# Altium project Probe.PrjPCB
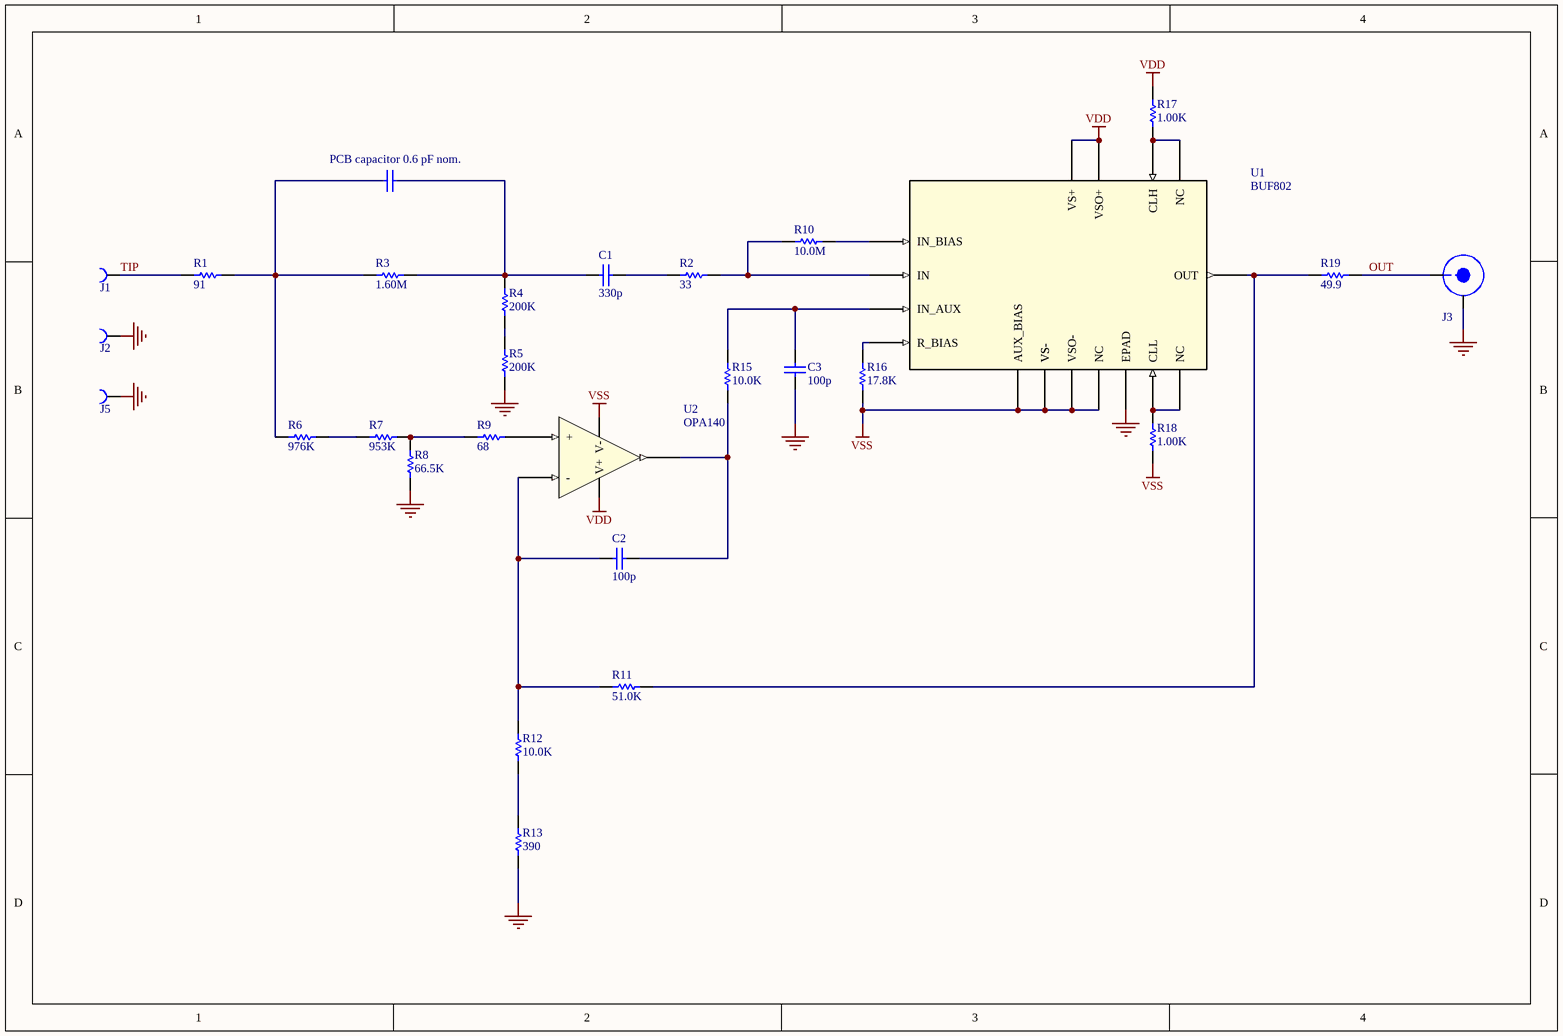
[diagram p0: Probe.SchDoc]
2 sheets, 57 parts. Net scope: global (net labels, ports and power ports of the same name join across sheets).
Board file: Probe.PcbDoc
Sheets:
  Probe.SchDoc
  Power.SchDoc

## Sheet Probe.SchDoc: Active probe evaluation board
size A4

### Parts
C1  330p  [CAPC0402(1005)50_M]
C2  100p  [CAPC0402(1005)50_M]
C3  100p  [CAPC0402(1005)50_M]
J1  0339-0-15-01-15-27-10-0  [MILL-MAX 0339]  (value not drawn)
J2  0339-0-15-01-15-27-10-0  [MILL-MAX 0339]  (value not drawn)
J3  901-10511-3  [901-10511-3]  (value not drawn)
J5  0339-0-15-01-15-27-10-0  [MILL-MAX 0339]  (value not drawn)
R1  91  [RESC0402(1005)_M]
R2  33  [RESC0402(1005)_M]
R3  1.60M  [RESC0402(1005)_M]
R4  200K  [RESC0402(1005)_M]
R5  200K  [RESC0402(1005)_M]
R6  976K  [RESC0402(1005)_M]
R7  953K  [RESC0402(1005)_M]
R8  66.5K  [RESC0402(1005)_M]
R9  68  [RESC0402(1005)_M]
R10  10.0M  [RESC0402(1005)_M]
R11  51.0K  [RESC0402(1005)_M]
R12  10.0K  [RESC0402(1005)_M]
R13  390  [RESC0402(1005)_M]
R15  10.0K  [RESC0402(1005)_M]
R16  17.8K  [RESC0402(1005)_M]
R17  1.00K  [RESC0402(1005)_M]
R18  1.00K  [RESC0402(1005)_M]
R19  49.9  [RESC0402(1005)_M]
U1  BUF802  [VQFN16_RGT_TEX- OSHPARK]
U2  OPA140  [SOIC-8]

### Nets
GND: C3.2 J2.1 J3.2 J5.1 R5.2 R8.2 R13.2 U1.17(EPAD)
VDD: R17.2 U1.1(VS+) U1.12(VSO+) U2.7(V+)
VSS: R16.2 R18.2 U1.5(VS-) U1.6(AUX_BIAS) U1.8(VS-) U1.9(NC) U1.10(VSO-) U2.4(V-)
OUT: J3.1 R19.2
TIP: J1.1 R1.1
NetC1_1: C1.1 R3.2 R4.1
NetC1_2: C1.2 R2.1
NetC2_1: C2.1 R11.1 R12.1 U2.2(-)
NetC2_2: C2.2 R15.2 U2.6(OUT)
NetC3_1: C3.1 R15.1 U1.4(IN_AUX)
NetR1_2: R1.2 R3.1 R6.1
NetR2_2: R2.2 R10.1 U1.2(IN)
NetR4_2: R4.2 R5.1
NetR6_2: R6.2 R7.1
NetR7_2: R7.2 R8.1 R9.1
NetR9_2: R9.2 U2.3(+)
NetR10_2: R10.2 U1.3(IN_BIAS)
NetR11_2: R11.2 R19.1 U1.11(OUT)
NetR12_2: R12.2 R13.1
NetR16_1: R16.1 U1.7(R_BIAS)
NetR17_1: R17.1 U1.15(CLH) U1.16(NC)
NetR18_1: R18.1 U1.13(NC) U1.14(CLL)

### Notes on the sheet
- PCB capacitor 0.6 pF nom.
- Title
- Size:
- Date:
- A4
- Number:
- Time:
- Revision:
- Sheet
- of
- File:

### Library data of the parts
C1 = GRM1555C1H331JA01: CAP CER 330PF±5% 50V C0G 0402; Manufacturer: Murata; Manufacturer Part Number: GRM1555C1H331JA01D; Capacitance: 330pF; Tolerance: ±5%; Value: 330p; Temperature Coefficient: C0G; Part Number: GRM1555C1H331JA01
C2 C3 = CL05C101JB5NNN: CAP CER 100PF±5% 50V C0G 0402; Manufacturer: Samsung Electro-Mechanics; Manufacturer Part Number: CL05C101JB5NNNC; Capacitance: 100pF; Tolerance: ±5%; Voltage Rating: 50V; Temperature Coefficient: C0G; Part Number: CL05C101JB5NNN; Value: 100p
J1 J2 J5 = 0339-0-15-01-15-27-10-0: CONN PIN RCPT; Manufacturer: Mill-Max; Supplier 1: Digi-Key; Supplier Part Number 1: 0339-0-15-01-15-27-10-0-ND; Manufacturer Part Number: 0339-0-15-01-15-27-10-0; Stock 1: 989; Pricing 1: 1=1.42, 10=1.234, 25=1.1812, 50=1.155, 100=1.1025, 250=0.99748, 500=0.91874, 1000=0.7875, 2500=0.735 (USD); Contact Material: Copper; Contact Plating: Gold; Min Operating Temperature: -55°C; Max Operating Temperature: 125°C; Series: 0339; Packaging: Bulk; Termination: Solder; RoHS Compliant: No; ComponentLink1URL: https://www.mill-max.com/assets/pdfs/172.pdf?src-supplier=Digi-Key; ComponentLink1Description: https://www.mill-max.com/assets/pdfs/172.pdf?src-supplier=Digi-Key; ComponentLink2URL: https://datasheet.octopart.com/0339-0-15-01-15-27-10-0-Mill-Max-datasheet-26446830.pdf?src-supplier=Future+Electronics; ComponentLink2Description: https://datasheet.octopart.com/0339-0-15-01-15-27-10-0-Mill-Max-datasheet-26446830.pdf?src-supplier=Future+Electronics; ComponentLink3URL: http://www.mouser.com/ds/2/273/172M-276194.pdf?src-supplier=Mouser; ComponentLink3Description: http://www.mouser.com/ds/2/273/172M-276194.pdf?src-supplier=Mouser; ComponentLink4URL: https://datasheet.octopart.com/0339-0-15-01-15-27-10-0-Mill-Max-datasheet-155663258.pdf?src-supplier=Sager+Electronics; ComponentLink4Description: https://datasheet.octopart.com/0339-0-15-01-15-27-10-0-Mill-Max-datasheet-155663258.pdf?src-supplier=Sager+Electronics; Supplier 2: Mouser; Supplier Part Number 2: 575-0339015011527100
J3 = 901-10511-3: CONN SMA JACK STR 50OHM EDGE MNT; Manufacturer: Amphenol RF; Impedance: 50R; Max Frequency: 26.5GHz; Voltage Rating: 170V; Supplier 1: Digi-Key; Manufacturer Part Number: 901-10511-3; Stock 1: 1568; Pricing 1: 1=9.78, 10=8.804, 25=8.2936, 50=8.081, 100=7.8684, 250=7.01772, 500=6.59242, 1000=5.82685 (USD); Case/Package: SMA; Contact Material: Copper; Min Operating Temperature: -65°C; Max Operating Temperature: 165°C; Connector Type: SMA; Fastening Type: Threaded; Series: -; Packaging: Bulk; Termination: Solder; ComponentLink1URL: https://datasheet.octopart.com/901-10511-3-Amphenol-RF-datasheet-67291285.pdf?src-supplier=Element14; ComponentLink1Description: https://datasheet.octopart.com/901-10511-3-Amphenol-RF-datasheet-67291285.pdf?src-supplier=Element14; Supplier 2: Mouser; Supplier Part Number 2: 523-901-10511-3; Supplier Part Number 1: ARF2500-ND; Mount: Edge,Board; RoHS Compliant: Yes; ComponentLink2URL: https://datasheet.octopart.com/901-10511-3-Amphenol-RF-datasheet-67291280.pdf?src-supplier=Newark; ComponentLink2Description: https://datasheet.octopart.com/901-10511-3-Amphenol-RF-datasheet-67291280.pdf?src-supplier=Newark; ComponentLink3URL: http://www.amphenolrf.com/media/downloads/7776/C901-10511-3.pdf?src-supplier=Digi-Key; ComponentLink3Description: http://www.amphenolrf.com/media/downloads/7776/C901-10511-3.pdf?src-supplier=Digi-Key
R1 = RESC0402-91R0-1pct: RES 91 OHM 1% 1/16W 0402; Manufacturer 1: Yageo; Manufacturer Part Number 1: RC0402FR-0791RL; Part Number: RESC0402-91R0-1pct; Ohms: 91; Value: 91; Manufacturer 2: Stackpole Electronics; Manufacturer Part Number 2: RMCF0402FT91R0; Manufacturer 3: Vishay Dale; Manufacturer Part Number 3: CRCW040291R0FKED; Manufacturer 4: Panasonic Electronic Components; Manufacturer Part Number 4: ERJ-2RKF91R0X
R2 = RESC0402-33R0-1pct: RES 33 OHM 1% 1/16W 0402; Manufacturer 1: Yageo; Manufacturer Part Number 1: RC0402FR-0733RL; Part Number: RESC0402-33R0-1pct; Ohms: 33; Value: 33; Manufacturer 2: Stackpole Electronics; Manufacturer Part Number 2: RMCF0402FT33R0; Manufacturer 3: Vishay Dale; Manufacturer Part Number 3: CRCW040233R0FKED; Manufacturer 4: Panasonic Electronic Components; Manufacturer Part Number 4: ERJ-2RKF33R0X
R3 = RESC0402-1M60-1pct: RES 1.60M OHM 1% 1/16W 0402; Manufacturer 1: Yageo; Manufacturer Part Number 1: RC0402FR-071M6L; Ohms: 1600000; Part Number: RESC0402-1M60-1pct; Value: 1.60M; Manufacturer 2: Stackpole Electronics; Manufacturer Part Number 2: RMCF0402FT1M60; Manufacturer 3: Vishay Dale; Manufacturer Part Number 3: CRCW04021M60FKED; Manufacturer 4: Panasonic Electronic Components
R4 R5 = RESC0402-200K-1pct: RES 200K OHM 1% 1/16W 0402; Manufacturer 1: Yageo; Manufacturer Part Number 1: RC0402FR-07200KL; Ohms: 200000; Part Number: RESC0402-200K-1pct; Value: 200K; Manufacturer 2: Stackpole Electronics; Manufacturer Part Number 2: RMCF0402FT200K; Manufacturer 3: Vishay Dale; Manufacturer Part Number 3: CRCW0402200KFKED; Manufacturer 4: Panasonic Electronic Components; Manufacturer Part Number 4: ERJ-2RKF2003X
R6 = RESC0402-976K-1pct: RES 976K OHM 1% 1/16W 0402; Manufacturer 1: Yageo; Manufacturer Part Number 1: RC0402FR-07976KL; Ohms: 976000; Part Number: RESC0402-976K-1pct; Value: 976K; Manufacturer 2: Stackpole Electronics; Manufacturer Part Number 2: RMCF0402FT976K; Manufacturer 3: Vishay Dale; Manufacturer Part Number 3: CRCW0402976KFKED; Manufacturer 4: Panasonic Electronic Components; Manufacturer Part Number 4: ERJ-2RKF9763X
R7 = RESC0402-953K-1pct: RES 953K OHM 1% 1/16W 0402; Manufacturer 1: Yageo; Manufacturer Part Number 1: RC0402FR-07953KL; Ohms: 953000; Part Number: RESC0402-953K-1pct; Value: 953K; Manufacturer 2: Stackpole Electronics; Manufacturer Part Number 2: RMCF0402FT953K; Manufacturer 3: Vishay Dale; Manufacturer Part Number 3: CRCW0402953KFKED; Manufacturer 4: Panasonic Electronic Components; Manufacturer Part Number 4: ERJ-2RKF9533X
R8 = RESC0402-66K5-1pct: RES 66.5K OHM 1% 1/16W 0402; Manufacturer 1: Yageo; Manufacturer Part Number 1: RC0402FR-0766K5L; Ohms: 66500; Part Number: RESC0402-66K5-1pct; Value: 66.5K; Manufacturer 2: Stackpole Electronics; Manufacturer Part Number 2: RMCF0402FT66K5; Manufacturer 3: Vishay Dale; Manufacturer Part Number 3: CRCW040266K5FKED; Manufacturer 4: Panasonic Electronic Components; Manufacturer Part Number 4: ERJ-2RKF6652X
R9 = RESC0402-68R0-1pct: RES 68 OHM 1% 1/16W 0402; Manufacturer 1: Yageo; Manufacturer Part Number 1: RC0402FR-0768RL; Part Number: RESC0402-68R0-1pct; Ohms: 68; Value: 68; Manufacturer 2: Stackpole Electronics; Manufacturer Part Number 2: RMCF0402FT68R0; Manufacturer 3: Vishay Dale; Manufacturer Part Number 3: CRCW040268R0FKED; Manufacturer 4: Panasonic Electronic Components; Manufacturer Part Number 4: ERJ-2RKF68R0X
R10 = RESC0402-10M0-1pct: RES 10.0M OHM 1% 1/16W 0402; Manufacturer 1: Yageo; Manufacturer Part Number 1: RC0402FR-0710ML; Ohms: 10000000; Part Number: RESC0402-10M0-1pct; Value: 10.0M; Manufacturer 2: Stackpole Electronics; Manufacturer Part Number 2: RMCF0402FT10M0; Manufacturer 3: Vishay Dale; Manufacturer Part Number 3: CRCW040210M0FKED; Manufacturer 4: Panasonic Electronic Components
R11 = RESC0402-51K0-1pct: RES 51.0K OHM 1% 1/16W 0402; Manufacturer 1: Yageo; Manufacturer Part Number 1: RC0402FR-0751KL; Ohms: 51000; Part Number: RESC0402-51K0-1pct; Value: 51.0K; Manufacturer 2: Stackpole Electronics; Manufacturer Part Number 2: RMCF0402FT51K0; Manufacturer 3: Vishay Dale; Manufacturer Part Number 3: CRCW040251K0FKED; Manufacturer 4: Panasonic Electronic Components; Manufacturer Part Number 4: ERJ-2RKF5102X
R12 R15 = RESC0402-10K0-1pct: RES 10.0K OHM 1% 1/16W 0402; Manufacturer 1: Yageo; Manufacturer Part Number 1: RC0402FR-0710KL; Ohms: 10000; Part Number: RESC0402-10K0-1pct; Value: 10.0K; Manufacturer 2: Stackpole Electronics; Manufacturer Part Number 2: RMCF0402FT10K0; Manufacturer 3: Vishay Dale; Manufacturer Part Number 3: CRCW040210K0FKED; Manufacturer 4: Panasonic Electronic Components; Manufacturer Part Number 4: ERJ-2RKF1002X
R13 = RESC0402-390R-1pct: RES 390 OHM 1% 1/16W 0402; Manufacturer 1: Yageo; Manufacturer Part Number 1: RC0402FR-07390RL; Part Number: RESC0402-390R-1pct; Ohms: 390; Value: 390; Manufacturer 2: Stackpole Electronics; Manufacturer Part Number 2: RMCF0402FT390R; Manufacturer 3: Vishay Dale; Manufacturer Part Number 3: CRCW0402390RFKED; Manufacturer 4: Panasonic Electronic Components; Manufacturer Part Number 4: ERJ-2RKF3900X
R16 = RESC0402-17K8-1pct: RES 17.8K OHM 1% 1/16W 0402; Manufacturer 1: Yageo; Manufacturer Part Number 1: RC0402FR-0717K8L; Ohms: 17800; Part Number: RESC0402-17K8-1pct; Value: 17.8K; Manufacturer 2: Stackpole Electronics; Manufacturer Part Number 2: RMCF0402FT17K8; Manufacturer 3: Vishay Dale; Manufacturer Part Number 3: CRCW040217K8FKED; Manufacturer 4: Panasonic Electronic Components; Manufacturer Part Number 4: ERJ-2RKF1782X
R17 R18 = RESC0402-1K00-1pct: RES 1.00K OHM 1% 1/16W 0402; Manufacturer 1: Yageo; Manufacturer Part Number 1: RC0402FR-071KL; Ohms: 1000; Part Number: RESC0402-1K00-1pct; Value: 1.00K; Manufacturer 2: Stackpole Electronics; Manufacturer Part Number 2: RMCF0402FT1K00; Manufacturer 3: Vishay Dale; Manufacturer Part Number 3: CRCW04021K00FKED; Manufacturer 4: Panasonic Electronic Components; Manufacturer Part Number 4: ERJ-2RKF1001X
R19 = RESC0402-49R9-1pct: RES 49.9 OHM 1% 1/16W 0402; Manufacturer 1: Yageo; Manufacturer Part Number 1: RC0402FR-0749R9L; Part Number: RESC0402-49R9-1pct; Ohms: 49.9; Value: 49.9; Manufacturer 2: Stackpole Electronics; Manufacturer Part Number 2: RMCF0402FT49R9; Manufacturer 3: Vishay Dale; Manufacturer Part Number 3: CRCW040249R9FKED; Manufacturer 4: Panasonic Electronic Components; Manufacturer Part Number 4: ERJ-2RKF49R9X
U1 = BUF802IRGTR: WIDE-BANDWIDTH JFET BUFFER; Manufacturer: Texas Instruments; Supplier 1: Digi-Key; Manufacturer Part Number: BUF802IRGTR; Stock 1: 1253; Pricing 1: 1=5.06, 10=4.541, 25=4.2928, 100=3.7206, 250=3.5298, 500=3.16728, 1000=2.88 (USD); Supplier 2: Mouser; Supplier Part Number 1: 296-BUF802IRGTRCT-ND; Supplier Part Number 2: 595-BUF802IRGTR
U2 = OPA140AIDR: IC OPAMP JFET 1 CIRCUIT 8SOIC; Manufacturer: Texas Instruments; Slew Rate: 20V/µs; Output Current per Channel: 36mA; Number of Circuits: 1; Gain Bandwidth Product: 11MHz; Input Bias Current: 10pA; Input Offset Voltage (Vos): 30uV; Operating Supply Current: 1.8mA; Min Dual Supply Voltage: 2.25V; Max Dual Supply Voltage: 18V; Max Supply Voltage: 36V; Min Supply Voltage: 4.5V; Nominal Supply Current: 2mA; Voltage Gain: 126dB; Max I/O Voltage: 120uV; Power Supply Rejection Ratio (PSRR): 140dB; Supplier 1: Digi-Key; Manufacturer Part Number: OPA140AIDR; Stock 1: 3434; Pricing 1: 1=4.01, 10=3.606, 25=3.4088, 100=2.9542, 250=2.80276, 500=2.5149, 1000=2.121 (USD); Number of Pins: 8; Min Operating Temperature: -40°C; Max Operating Temperature: 125°C; Series: -; Packaging: Tape and Reel; RoHS Compliant: Yes; ComponentLink1URL: https://datasheet.ciiva.com/14459/sbos498a-14459066.pdf?src-supplier=Avnet; ComponentLink1Description: https://datasheet.ciiva.com/14459/sbos498a-14459066.pdf?src-supplier=Avnet; Supplier 2: Mouser; Supplier Part Number 1: 296-43606-6-ND; Supplier Part Number 2: 595-OPA140AIDR; Case/Package: D; Contact Plating: Gold; Package Quantity: 2500; Number of Elements: 1; Output Current: 36mA; Unity Gain Bandwidth Product: 11MHz; Common Mode Rejection Ratio: 126dB; Nominal Gain Bandwidth Product: 11MHz; Number of Channels: 1; Operating Supply Voltage: 18V; Supply Current: 2mA; Technology: BIFET; Radiation Hardening: No; Lead Free: Lead Free; ComponentLink2URL: https://datasheet.ciiva.com/1815/opa140-1815515.pdf?src-supplier=Digi-Key; ComponentLink2Description: https://datasheet.ciiva.com/1815/opa140-1815515.pdf?src-supplier=Digi-Key

## Sheet Power.SchDoc
size A4
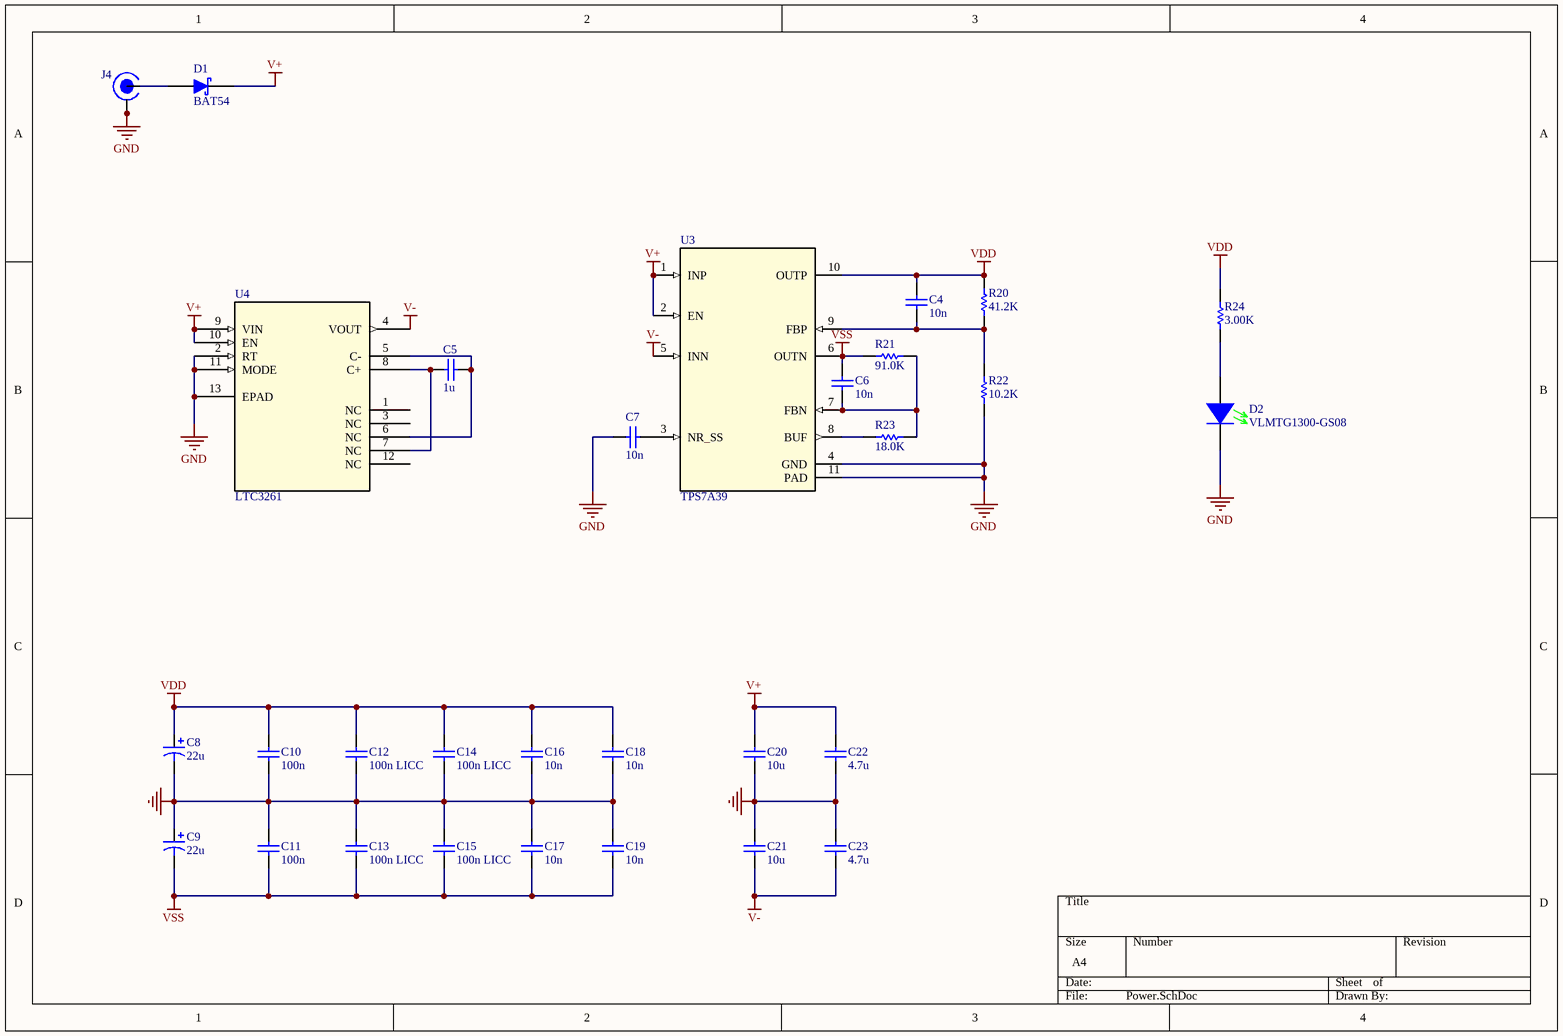
[diagram p1: Power.SchDoc]

### Parts
C4  10n  [CAPC0402(1005)50_M]
C5  1u  [CAPC0805(2012)145_M]
C6  10n  [CAPC0402(1005)50_M]
C7  10n  [CAPC0402(1005)50_M]
C8  22u  [KEMET D_M]
C9  22u  [KEMET D_M]
C10  100n  [CAPC0603(1608)100_M]
C11  100n  [CAPC0603(1608)100_M]
C12  100n LICC  [CAPC0306_M]
C13  100n LICC  [CAPC0306_M]
C14  100n LICC  [CAPC0306_M]
C15  100n LICC  [CAPC0306_M]
C16  10n  [CAPC0402(1005)50_M]
C17  10n  [CAPC0402(1005)50_M]
C18  10n  [CAPC0402(1005)50_M]
C19  10n  [CAPC0402(1005)50_M]
C20  10u  [CAPC1206(3216)170_M]
C21  10u  [CAPC1206(3216)170_M]
C22  4.7u  [CAPC0805(2012)100_M]
C23  4.7u  [CAPC0805(2012)100_M]
D1  BAT54  [INF-PG-SC59_M]
D2  VLMTG1300-GS08  [LED0603(1608)_M]
J4  2.1/5.5mm  [CUI PJ-002A]  (value not drawn)
R20  41.2K  [RESC0402(1005)_M]
R21  91.0K  [RESC0402(1005)_M]
R22  10.2K  [RESC0402(1005)_M]
R23  18.0K  [RESC0402(1005)_M]
R24  3.00K  [RESC0603(1608)_M]
U3  TPS7A39  [DSC0010J_NV]
U4  LTC3261  [MSOP-12_MSE]

### Nets
GND: C7.2 C8.2 C9.1 C10.2 C11.1 C12.2 C13.1 C14.2 C15.1 C16.2 C17.1 C18.2 C19.1 C20.2 C21.1 C22.2 C23.2 D2.2(K) J4.2 J4.3 R22.2 U3.4(GND) U3.11(PAD) U4.2(RT) U4.11(MODE) U4.13(EPAD)
V+: C20.1 C22.1 D1.3(K) U3.1(INP) U3.2(EN) U4.9(VIN) U4.10(EN)
V-: C21.2 C23.1 U3.5(INN) U4.4(VOUT)
VDD: C4.2 C8.1 C10.1 C12.1 C14.1 C16.1 C18.1 R20.1 R24.1 U3.10(OUTP)
VSS: C6.2 C9.2 C11.2 C13.2 C15.2 C17.2 C19.2 R21.2 U3.6(OUTN)
NetC4_1: C4.1 R20.2 R22.1 U3.9(FBP)
NetC5_1: C5.1 U4.7(NC) U4.8(C+)
NetC5_2: C5.2 U4.5(C-) U4.6(NC)
NetC6_1: C6.1 R21.1 R23.1 U3.7(FBN)
NetC7_1: C7.1 U3.3(NR_SS)
NetD1_1: D1.1(A) J4.1
NetD2_1: D2.1(A) R24.2
NetR23_2: R23.2 U3.8(BUF)

Not connected (* = marked no-connect by the designer): U4 1(NC) 3(NC) 12(NC)

### Library data of the parts
C4 C6 C7 = GRM1555C1E103JE01: CAP CER 10NF±5% 25V C0G 0402; Manufacturer: Murata; Manufacturer Part Number: GRM1555C1E103JE01D; Tolerance: ±5%; Capacitance: 10nF; Part Number: GRM1555C1E103JE01; Value: 10n; Temperature Coefficient: C0G
C5 = CC0805KKX7R9BB105: Cap Ceramic 1uF 50V X7R 10% SMD 0805 125C Blister T/R; Manufacturer: Yageo; Supplier 1: Digi-Key; Manufacturer Part Number: CC0805KKX7R9BB105; Stock 1: 558291; Pricing 1: 1=0.27, 10=0.188, 100=0.1064, 500=0.0751, 1000=0.06571 (USD); Mount: Surface Mount; Case/Package: 0805; Weight: 0.000194oz; Case Code (Imperial): 0805; Case Code (Metric): 2012; Min Operating Temperature: -55°C; Max Operating Temperature: 125°C; Tolerance: 10%; Packaging: Tape and Reel; Capacitance: 1uF; Voltage Rating: 50V; Voltage Rating (DC): 50V; Dielectric: X7R; Termination: SMD/SMT; Composition: Ceramic; Length: 2mm; Height: 1.25mm; Width: 0.049inch; Thickness: 0.057inch; Depth: 1.25mm; Radiation Hardening: No; Lead Free: Lead Free; Halogen Free: Halogen Free; ComponentLink1URL: http://www.mouser.com/ds/2/447/Yageo_UPY-GP_NP0_16V-to-50V_9-358835.pdf?src-supplier=Mouser; ComponentLink1Description: http://www.mouser.com/ds/2/447/Yageo_UPY-GP_NP0_16V-to-50V_9-358835.pdf?src-supplier=Mouser; Supplier 2: Mouser; Supplier Part Number 2: 603-CC805KKX7R9BB105; Supplier Part Number 1: 311-1886-1-ND
C8 C9 = T491D226K016AT: CAP TANT 22UF 10% 16V 2917; Manufacturer: KEMET; Dielectric Material: Tantalum; Tolerance: 20%; ESR (Equivalent Series Resistance): 800mR; Polarity: Polar; Dissipation Factor: 6%; Life (Hours): 2000Hour; Leakage Current: 3.6uA; Ripple Current: 433mA; Supplier 1: Digi-Key; Supplier Part Number 1: 399-3780-6-ND; Manufacturer Part Number: T491D226K016AT; Stock 1: 26983; Pricing 1: 1=0.96, 10=0.726, 50=0.6034, 100=0.5197 (USD); Mount: Surface Mount,PCB; Case/Package: 2917; Case Code (Imperial): 2917; Case Code (Metric): 7343; Min Operating Temperature: -55°C; Max Operating Temperature: 125°C; Capacitance: 22uF; Packaging: Tape and Reel; Construction: Flat; Voltage Rating: 16V; Series: T491; Termination: SMD/SMT; Package Quantity: 500; Voltage Rating (DC): 16V; Features: General Purpose; Voltage: 16V; Length: 7.3mm; Width: 4.3mm; Height: 2.8mm; Depth: 4.3mm; Height - Seated (Max): 0.122inch; Radiation Hardening: No; RoHS Compliant: Yes; Lead Free: Lead Free; Reach SVHC Compliant: Yes; ComponentLink1URL: https://datasheet.ciiva.com/34302/1574321-34302540.pdf?src-supplier=Jameco; ComponentLink1Description: https://datasheet.ciiva.com/34302/1574321-34302540.pdf?src-supplier=Jameco; ComponentLink2URL: https://datasheet.ciiva.com/259/kem-t2005-t491-259126.pdf?src-supplier=Digi-Key; ComponentLink2Description: https://datasheet.ciiva.com/259/kem-t2005-t491-259126.pdf?src-supplier=Digi-Key; ComponentLink3URL: https://datasheet.ciiva.com/11793/0900766b80718482-11793767.pdf?src-supplier=Rs; ComponentLink3Description: https://datasheet.ciiva.com/11793/0900766b80718482-11793767.pdf?src-supplier=Rs; ComponentLink4URL: https://datasheet.ciiva.com/5934/kem-t2005-t491-5934828.pdf?src-supplier=Farnell; ComponentLink4Description: https://datasheet.ciiva.com/5934/kem-t2005-t491-5934828.pdf?src-supplier=Farnell; ComponentLink5URL: https://datasheet.ciiva.com/8079/kem-t2005-t491-8079802.pdf?src-supplier=Element14; ComponentLink5Description: https://datasheet.ciiva.com/8079/kem-t2005-t491-8079802.pdf?src-supplier=Element14; ComponentLink6URL: https://datasheet.ciiva.com/32431/t491serie-eng-tds-32431607.pdf?src-supplier=Distrelec; ComponentLink6Description: https://datasheet.ciiva.com/32431/t491serie-eng-tds-32431607.pdf?src-supplier=Distrelec; ComponentLink7URL: https://datasheet.ciiva.com/7696/1854511-7696357.pdf?src-supplier=Element14; ComponentLink7Description: https://datasheet.ciiva.com/7696/1854511-7696357.pdf?src-supplier=Element14; ComponentLink8URL: https://datasheet.ciiva.com/259/kem-t2005-t491-259127.pdf?src-supplier=Digi-Key; ComponentLink8Description: https://datasheet.ciiva.com/259/kem-t2005-t491-259127.pdf?src-supplier=Digi-Key; ComponentLink9URL: https://datasheet.ciiva.com/259/kem-t2005-t491-259128.pdf?src-supplier=Digi-Key; ComponentLink9Description: https://datasheet.ciiva.com/259/kem-t2005-t491-259128.pdf?src-supplier=Digi-Key; ComponentLink10URL: https://datasheet.ciiva.com/14610/70095774-14610140.pdf?src-supplier=Allied+Electronics; ComponentLink10Description: https://datasheet.ciiva.com/14610/70095774-14610140.pdf?src-supplier=Allied+Electronics; ComponentLink11URL: https://datasheet.ciiva.com/12883/kem-t2005-t491-12883292.pdf?src-supplier=Mouser; ComponentLink11Description: https://datasheet.ciiva.com/12883/kem-t2005-t491-12883292.pdf?src-supplier=Mouser; Supplier 2: Mouser; Supplier Part Number 2: 80-T491D226K016
C10 C11 = CC0603KRX7R9BB104: CAPACITOR CERAMIC, 0.1UF, 50V, X7R, 10%, 0603; Manufacturer: Yageo; Capacitance: 100nF; Supplier 1: Digi-Key; Manufacturer Part Number: CC0603KRX7R9BB104; Stock 1: 0; Pricing 1: 1=0.1, 10=0.066, 50=0.036, 100=0.0293, 500=0.02094, 1000=0.01646 (USD); Mount: Surface Mount; Case/Package: 0603; Number of Pins: 2; Case Code (Metric): 1608; Case Code (Imperial): 0603; Dielectric Material: Ceramic; Min Operating Temperature: -55°C; Max Operating Temperature: 125°C; Package Quantity: 1; Voltage Rating: 50V; Tolerance: 10%; Packaging: Tape and Reel; Dielectric: X7R; Termination: SMD/SMT; Voltage: 50V; Length: 1.6mm; Height: 0.8mm; Width: 0.031inch; Thickness: 0.035inch; Depth: 0.8mm; Radiation Hardening: No; REACH SVHC: No SVHC; Lead Free: Lead Free; Halogen Free: Halogen Free; ComponentLink1URL: http://www.yageo.com/documents/recent/UPY-GPHC_X7R_6.3V-to-50V_18.pdf?src-supplier=Digi-Key; ComponentLink1Description: http://www.yageo.com/documents/recent/UPY-GPHC_X7R_6.3V-to-50V_18.pdf?src-supplier=Digi-Key; ComponentLink2URL: http://www.farnell.com/datasheets/1489800.pdf?src-supplier=Element14; ComponentLink2Description: http://www.farnell.com/datasheets/1489800.pdf?src-supplier=Element14; ComponentLink3URL: http://www.yageo.com/documents/recent/UPY-GPHC_X7R_6.3V-to-50V_8.pdf?src-supplier=Avnet+Europe; ComponentLink3Description: http://www.yageo.com/documents/recent/UPY-GPHC_X7R_6.3V-to-50V_8.pdf?src-supplier=Avnet+Europe; ComponentLink4URL: http://www.farnell.com/datasheets/2167236.pdf?src-supplier=Element14; ComponentLink4Description: http://www.farnell.com/datasheets/2167236.pdf?src-supplier=Element14; ComponentLink5URL: http://www.farnell.com/datasheets/1489800.pdf?src-supplier=Farnell; ComponentLink5Description: http://www.farnell.com/datasheets/1489800.pdf?src-supplier=Farnell; Supplier 2: Mouser; Supplier Part Number 1: 311-1344-1-ND; Supplier Part Number 2: 603-CC603KRX7R9BB104; LCSC PART #: C14663
C12-C15 = TWK107B7104MVHT: CAP CER 0.1UF 25V X7R 0306; Manufacturer: Taiyo Yuden; Capacitance: 100nF; Tolerance: 20%; Supplier 1: Digi-Key; Manufacturer Part Number: TWK107B7104MVHT; Stock 1: 9611; Pricing 1: 1=0.31, 10=0.219, 50=0.153, 100=0.1312, 500=0.0984, 1000=0.08309 (USD); Mount: Surface Mount; Case/Package: 0306; Case Code (Imperial): 0306; Case Code (Metric): 0816; Min Operating Temperature: -55°C; Max Operating Temperature: 125°C; Packaging: Tape and Reel; Voltage Rating: 25V; Ratings: AEC-Q200; RoHS Compliant: Yes; ComponentLink1URL: http://ds.yuden.co.jp/TYCOMPAS/ut/detail.do?productNo=TWK107B7104MVHT&amp;fileName=TWK107B7104MVHT_SS&amp;mode=specSheetDownload&src-supplier=Digi-Key; ComponentLink1Description: http://ds.yuden.co.jp/TYCOMPAS/ut/detail.do?productNo=TWK107B7104MVHT&amp;fileName=TWK107B7104MVHT_SS&amp;mode=specSheetDownload&src-supplier=Digi-Key; ComponentLink2URL: https://ds.yuden.co.jp/TYCOMPAS/ut/detail?pn=TWK107B7104MVHT &amp;u=M&src-supplier=Digi-Key; ComponentLink2Description: https://ds.yuden.co.jp/TYCOMPAS/ut/detail?pn=TWK107B7104MVHT &amp;u=M&src-supplier=Digi-Key; Supplier 2: Mouser; Supplier Part Number 1: 587-6181-1-ND; Supplier Part Number 2: 963-TWK107B7104MVHT
C16-C19 = GRM155R71H103KA88: CAP CER 10NF±10% 50V X7R 0402; Manufacturer: Murata; Manufacturer Part Number: GRM155R71H103KA88D; Capacitance: 10nF; Tolerance: ±10%; Part Number: GRM155R71H103KA88; Value: 10n; Temperature Coefficient: X7R
C20 C21 = CL31B106KBHNNNE: CAP CER 10UF 50V X7R 1206; Manufacturer: Samsung; Tolerance: 10%; Supplier 1: Digi-Key; Manufacturer Part Number: CL31B106KBHNNNE; Stock 1: 146990; Pricing 1: 1=0.42, 10=0.292, 100=0.1754, 500=0.13158, 1000=0.1111 (USD); Mount: Surface Mount; Case/Package: 1206; Case Code (Metric): 3216; Case Code (Imperial): 1206; Min Operating Temperature: -55°C; Max Operating Temperature: 125°C; Capacitance: 10uF; Voltage Rating: 50V; Packaging: Tape and Reel; Dielectric: X7R; Length: 0.126inch; Width: 0.063inch; Thickness: 0.071inch; Lead Free: Lead Free; ComponentLink1URL: http://www.samsungsem.com/kr/support/product-search/mlcc/CL31B106KBHNNNE.jsp?src-supplier=Digi-Key; ComponentLink1Description: http://www.samsungsem.com/kr/support/product-search/mlcc/CL31B106KBHNNNE.jsp?src-supplier=Digi-Key; Supplier Part Number 1: 1276-6767-1-ND; Voltage Rating (DC): 50V; LCSC PART #: C89632
C22 C23 = GRM21BZ71H475KE15K: CAP CER 4.7UF 50V X7R 0805; Manufacturer: Murata; Supplier 1: Digi-Key; Supplier Part Number 1: 490-GRM21BZ71H475KE15KCT-ND; Manufacturer Part Number: GRM21BZ71H475KE15K; Stock 1: 134344; Pricing 1: 1=0.6, 10=0.444, 50=0.3554, 100=0.3047, 500=0.2412, 1000=0.20311, 2500=0.19042, 5000=0.17772 (USD); RoHS Compliant: Yes; ComponentLink1URL: https://datasheet.octopart.com/GRM21BZ71H475KE15K-Murata-datasheet-149523520.pdf?src-supplier=Newark; ComponentLink1Description: https://datasheet.octopart.com/GRM21BZ71H475KE15K-Murata-datasheet-149523520.pdf?src-supplier=Newark; ComponentLink2URL: https://datasheet.octopart.com/GRM21BZ71H475KE15K-Murata-datasheet-165579666.pdf?src-supplier=TME; ComponentLink2Description: https://datasheet.octopart.com/GRM21BZ71H475KE15K-Murata-datasheet-165579666.pdf?src-supplier=TME; Supplier 2: Mouser; Supplier Part Number 2: 81-GRM21BZ71H475KE5K
D1 = BAT54: DIODE SCHOTTKY 30V 200MA TO236AB; Manufacturer: Nexperia USA; Manufacturer Part Number: BAT54,215; Supplier 1: Digi-Key; Supplier Part Number 1: 1727-2900-6-ND; Stock 1: 0
D2 = VLMTG1300-GS08: LED GREEN 0603 SMD; Manufacturer: Vishay Semiconductors; Viewing Angle: 130°; Lens Style: Rectangular,Clear; Wavelength: 525nm; Forward Voltage: 3.2V; Luminous Intensity: 450mcd; Forward Current: 20mA; Power Rating: 75mW; Number of Elements: 1; Power Dissipation: 76mW; Supplier 1: Digi-Key; Supplier Part Number 1: VLMTG1300-GS08CT-ND; Manufacturer Part Number: VLMTG1300-GS08; Stock 1: 156996; Pricing 1: 1=0.46, 10=0.305, 100=0.2033, 500=0.1406, 1000=0.11716 (USD); Mount: Surface Mount; Case/Package: 0603; Number of Pins: 2; Color: Green; Case Code (Metric): 1608; Case Code (Imperial): 0603; Contact Plating: Tin,Matte; Min Operating Temperature: -35°C; Max Operating Temperature: 85°C; Package Quantity: 1; Packaging: Tape and Reel; Illumination Color: Green; Dominant Wavelength: 525nm; Test Current: 20mA; Number of LEDs: 1; Max Power Dissipation: 76mW; Series: CHipLED; Length: 1.6mm; Width: 0.8mm; Height: 0.8mm; Depth: 0.8mm; Radiation Hardening: No; Lead Free: Lead Free; RoHS Compliant: Yes; ComponentLink1URL: https://datasheet.ciiva.com/26322/vlmo1300-26322149.pdf?src-supplier=Element14; ComponentLink1Description: https://datasheet.ciiva.com/26322/vlmo1300-26322149.pdf?src-supplier=Element14; ComponentLink2URL: https://datasheet.ciiva.com/8028/vlmo1300-8028077.pdf?src-supplier=Element14; ComponentLink2Description: https://datasheet.ciiva.com/8028/vlmo1300-8028077.pdf?src-supplier=Element14; ComponentLink3URL: https://datasheet.ciiva.com/16510/vlmo1300-16510989.pdf?src-supplier=Future+Electronics; ComponentLink3Description: https://datasheet.ciiva.com/16510/vlmo1300-16510989.pdf?src-supplier=Future+Electronics; ComponentLink4URL: https://datasheet.ciiva.com/2115/vlmo1300-2115107.pdf?src-supplier=Digi-Key; ComponentLink4Description: https://datasheet.ciiva.com/2115/vlmo1300-2115107.pdf?src-supplier=Digi-Key; ComponentLink5URL: https://datasheet.ciiva.com/2115/vlmo1300-2115108.pdf?src-supplier=Digi-Key; ComponentLink5Description: https://datasheet.ciiva.com/2115/vlmo1300-2115108.pdf?src-supplier=Digi-Key; ComponentLink6URL: https://datasheet.ciiva.com/2115/vlmo1300-2115106.pdf?src-supplier=Digi-Key; ComponentLink6Description: https://datasheet.ciiva.com/2115/vlmo1300-2115106.pdf?src-supplier=Digi-Key; Supplier 2: Mouser; Supplier Part Number 2: 78-VLMTG1300-GS08
J4 = PJ-002A: CONN PWR JACK 2X5.5MM SOLDER; Manufacturer: CUI; Gender: Male; Shielding: Unshielded; Current Rating: 2.5A; Number of Conductors: 2; Voltage Rating: 24V; Insulation Resistance: 50MR; Supplier 1: Digi-Key; Manufacturer Part Number: PJ-002A; Stock 1: 60290; Pricing 1: 1=0.6, 10=0.558, 25=0.5024, 50=0.4464, 100=0.4278, 250=0.3906, 500=0.372, 1000=0.3069, 2500=0.279 (USD); Mount: Through Hole; Color: Black; Contact Material: Copper Alloy,Copper; Contact Plating: Tin,Nickel; Housing Material: Thermoplastic; Housing Color: Black; Min Operating Temperature: -25°C; Max Operating Temperature: 85°C; Connector Type: Jack; Termination: Through Hole; Packaging: Bulk; Package Quantity: 500; Orientation: Horizontal; Contact Gender: Male; Diameter: 2.1mm; Lead Free: Lead Free; Flammability Rating: UL94 V-0; Supplier 2: Mouser; Supplier Part Number 1: CP-002A-ND; Supplier Part Number 2: 490-PJ-002A
R20 = RESC0402-41K2-1pct: RES 41.2K OHM 1% 1/16W 0402; Manufacturer 1: Yageo; Manufacturer Part Number 1: RC0402FR-0741K2L; Ohms: 41200; Part Number: RESC0402-41K2-1pct; Value: 41.2K; Manufacturer 2: Stackpole Electronics; Manufacturer Part Number 2: RMCF0402FT41K2; Manufacturer 3: Vishay Dale; Manufacturer Part Number 3: CRCW040241K2FKED; Manufacturer 4: Panasonic Electronic Components; Manufacturer Part Number 4: ERJ-2RKF4122X
R21 = RESC0402-91K0-1pct: RES 91.0K OHM 1% 1/16W 0402; Manufacturer 1: Yageo; Manufacturer Part Number 1: RC0402FR-0791KL; Ohms: 91000; Part Number: RESC0402-91K0-1pct; Value: 91.0K; Manufacturer 2: Stackpole Electronics; Manufacturer Part Number 2: RMCF0402FT91K0; Manufacturer 3: Vishay Dale; Manufacturer Part Number 3: CRCW040291K0FKED; Manufacturer 4: Panasonic Electronic Components; Manufacturer Part Number 4: ERJ-2RKF9102X
R22 = RESC0402-10K2-1pct: RES 10.2K OHM 1% 1/16W 0402; Manufacturer 1: Yageo; Manufacturer Part Number 1: RC0402FR-0710K2L; Ohms: 10200; Part Number: RESC0402-10K2-1pct; Value: 10.2K; Manufacturer 2: Stackpole Electronics; Manufacturer Part Number 2: RMCF0402FT10K2; Manufacturer 3: Vishay Dale; Manufacturer Part Number 3: CRCW040210K2FKED; Manufacturer 4: Panasonic Electronic Components; Manufacturer Part Number 4: ERJ-2RKF1022X
R23 = RESC0402-18K0-1pct: RES 18.0K OHM 1% 1/16W 0402; Manufacturer 1: Yageo; Manufacturer Part Number 1: RC0402FR-0718KL; Ohms: 18000; Part Number: RESC0402-18K0-1pct; Value: 18.0K; Manufacturer 2: Stackpole Electronics; Manufacturer Part Number 2: RMCF0402FT18K0; Manufacturer 3: Vishay Dale; Manufacturer Part Number 3: CRCW040218K0FKED; Manufacturer 4: Panasonic Electronic Components; Manufacturer Part Number 4: ERJ-2RKF1802X
R24 = RESC0603-3K00-1pct: RES 3.00K OHM 1% 1/10W 0603; Manufacturer 1: Yageo; Manufacturer Part Number 1: RC0603FR-073KL; Ohms: 3000; Part Number: RESC0603-3K00-1pct; Value: 3.00K; Manufacturer 2: Stackpole Electronics; Manufacturer Part Number 2: RMCF0603FT3K00; Manufacturer 3: Vishay Dale; Manufacturer Part Number 3: CRCW06033K00FKEA; Manufacturer 4: Panasonic Electronic Components; Manufacturer Part Number 4: ERJ-3EKF3001V
U3 = TPS7A3901DSCR: IC REG LINEAR POS/NEG ADJ 10WSON; Mfr_Name: Texas Instruments; Output Type: Adjustable; Number of Regulators: 2; Max Input Voltage: 33V; Min Output Voltage: 0V; Max Output Voltage: -30V; Dropout Voltage: 500mV; Output Current: 150mA; Quiescent Current: 150uA; Max Supply Current: 904uA; Power Supply Rejection Ratio (PSRR): 69dB; Type: DEV; RefDes: RefDes; Copyright: Copyright (C) 2022 Ultra Librarian. All rights reserved.; Manufacturer_Part_Number: TPS7A3901DSCR; Supplier 1: Digi-Key; Manufacturer: Texas Instruments; Manufacturer Part Number: TPS7A3901DSCR; Stock 1: 0; Mount: Surface Mount; Min Operating Temperature: -40°C; Max Operating Temperature: 125°C; Packaging: Cut Tape; Series: -; ComponentLink1URL: http://www.ti.com/lit/ds/symlink/tps7a39.pdf?src-supplier=Digi-Key; ComponentLink1Description: http://www.ti.com/lit/ds/symlink/tps7a39.pdf?src-supplier=Digi-Key; ComponentLink2URL: http://www.ti.com/general/docs/suppproductinfo.tsp?distId=10&amp;gotoUrl=http%3A%2F%2Fwww.ti.com%2Flit%2Fgpn%2Ftps7a39&src-supplier=Digi-Key; ComponentLink2Description: http://www.ti.com/general/docs/suppproductinfo.tsp?distId=10&amp;gotoUrl=http%3A%2F%2Fwww.ti.com%2Flit%2Fgpn%2Ftps7a39&src-supplier=Digi-Key; Supplier 2: Mouser; Supplier Part Number 1: 296-TPS7A3901DSCRCT-ND; Supplier Part Number 2: 595-TPS7A3901DSCR
U4 = LTC3261EMSE: IC REG CHARG PUMP INV 12MSOP; pin to pad: 13>EPAD; Mfr_Name: Linear Technology; Manufacturer_Part_Number: ltc3261emse#pbf; Manufacturer: Analog Devices / Linear Technology; Manufacturer Part Number: LTC3261EMSE#TRPBF; Number of Outputs: 1; Min Supply Voltage: 4.5V; Max Supply Voltage: 32V; Max Output Current: 100mA; Output Voltage: -32V; Switching Frequency: 500kHz; Synchronous Rectifier: No; Operating Supply Current: 60uA; Output Type: Adjustable; Copyright: Copyright (C) 2022 Ultra Librarian. All rights reserved.; RefDes: RefDes; Type: DEV; Supplier 1: Digi-Key; Stock 1: 0; Case/Package: SOP; Number of Pins: 12; Min Operating Temperature: -40°C; Max Operating Temperature: 125°C; Package Quantity: 2500; Packaging: Tape and Reel; Max Input Voltage: 32V; Min Input Voltage: 4.5V; Output Current: 100mA; Series: -; Lead Free: Lead Free; RoHS Compliant: Yes; ComponentLink1URL: http://components.arrow.com/part/dataview/53470050S89425N7433?src-supplier=Arrow+Electronics; ComponentLink1Description: http://components.arrow.com/part/dataview/53470050S89425N7433?src-supplier=Arrow+Electronics; ComponentLink2URL: http://cds.linear.com/docs/en/datasheet/3261fb.pdf?src-supplier=Digi-Key; ComponentLink2Description: http://cds.linear.com/docs/en/datasheet/3261fb.pdf?src-supplier=Digi-Key; ComponentLink3URL: http://www.linear.com/docs/44087?src-supplier=Digi-Key; ComponentLink3Description: http://www.linear.com/docs/44087?src-supplier=Digi-Key; Supplier 2: Mouser; Supplier 3: Newark; Supplier Part Number 1: LTC3261EMSE#TRPBFCT-ND; Supplier Part Number 2: 584-LTC3261EMSETRPBF; Supplier Part Number 3: 50AK2864

## Nets that join several sheets
GND: Probe (8 pins), Power (26 pins)
VDD: Probe (R17.2 U1.1 U1.12 U2.7), Power (10 pins)
VSS: Probe (8 pins), Power (9 pins)